# EAGLE design compashin_izzonu_fine (EAGLE 9.6.2)
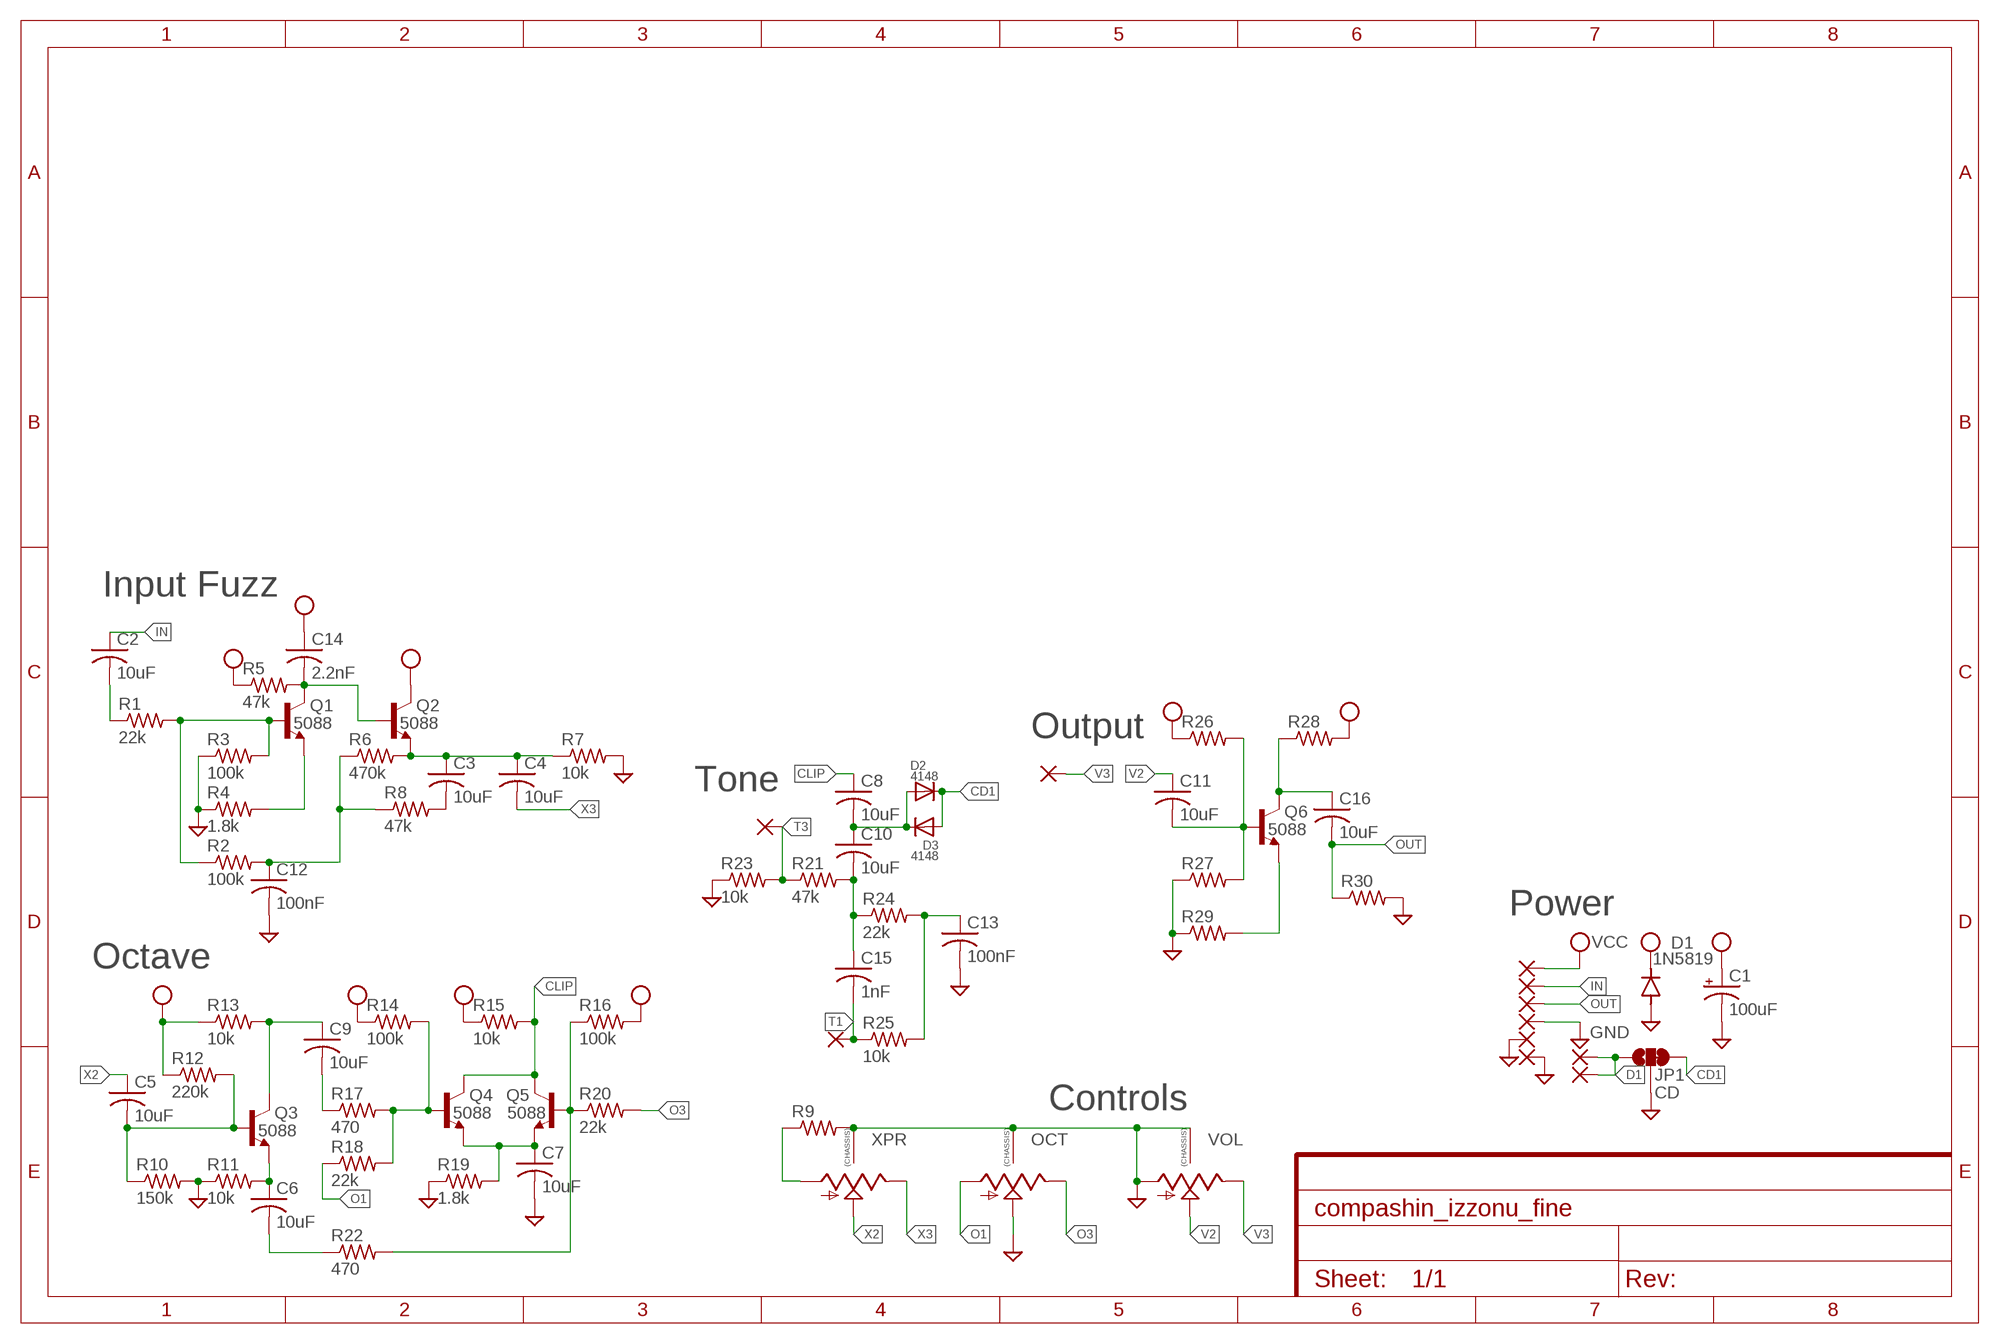
[diagram p0: schematic, sheet 1]

## Parts
C1  100uF  100UF-POLAR-RADIAL-2.5MM-25V-20%  [CPOL-RADIAL-2.5MM-6.5MM]
C2  10uF  C-USC0805  [C0805]
C3  10uF  C-USC0805  [C0805]
C4  10uF  C-USC0805  [C0805]
C5  10uF  C-USC0805  [C0805]
C6  10uF  C-USC0805  [C0805]
C7  10uF  C-USC0805  [C0805]
C8  10uF  C-USC0805  [C0805]
C9  10uF  C-USC0805  [C0805]
C10  10uF  C-USC0805  [C0805]
C11  10uF  C-USC0805  [C0805]
C12  100nF  C-USC0402  [C0402]
C13  100nF  C-USC0402  [C0402]
C14  2.2nF  C-USC0402  [C0402]
C15  1nF  C-USC0402  [C0402]
C16  10uF  C-USC0805  [C0805]
D1  1N5819  DIODE-SOD123  [SOD123]
D2  4148  DIODESOD-123  [SOD-123]
D3  4148  DIODESOD-123  [SOD-123]
JP1  CD  JUMPER-SMT_3_1-NC_TRACE_SILK  [SMT-JUMPER_3_1-NC_TRACE_SILK]
OCT  9MM_SNAP-IN_POT_CHASSIS  [9MM_SNAP-IN_POT]
PAD1  1,6/0,8  [1,6/0,8]
PAD2  1,6/0,8  [1,6/0,8]
PAD3  1,6/0,8  [1,6/0,8]
PAD4  1,6/0,8  [1,6/0,8]
PAD5  1,6/0,8  [1,6/0,8]
PAD6  1,6/0,8  [1,6/0,8]
PAD7  1,6/0,8  [1,6/0,8]
PAD8  1,6/0,8  [1,6/0,8]
Q1  5088  MMBT5088  [SOT23-BEC]
Q2  5088  MMBT5088  [SOT23-BEC]
Q3  5088  MMBT5088  [SOT23-BEC]
Q4  5088  MMBT5088  [SOT23-BEC]
Q5  5088  MMBT5088  [SOT23-BEC]
Q6  5088  MMBT5088  [SOT23-BEC]
R1  22k  R-US_R0402  [R0402]
R2  100k  R-US_R0402  [R0402]
R3  100k  R-US_R0402  [R0402]
R4  1.8k  R-US_R0402  [R0402]
R5  47k  R-US_R0402  [R0402]
R6  470k  R-US_R0402  [R0402]
R7  10k  R-US_R0402  [R0402]
R8  47k  R-US_R0402  [R0402]
R9  R-US_R0402  [R0402]
R10  150k  R-US_R0402  [R0402]
R11  10k  R-US_R0402  [R0402]
R12  220k  R-US_R0402  [R0402]
R13  10k  R-US_R0402  [R0402]
R14  100k  R-US_R0402  [R0402]
R15  10k  R-US_R0402  [R0402]
R16  100k  R-US_R0402  [R0402]
R17  470  R-US_R0402  [R0402]
R18  22k  R-US_R0402  [R0402]
R19  1.8k  R-US_R0402  [R0402]
R20  22k  R-US_R0402  [R0402]
R21  47k  R-US_R0402  [R0402]
R22  470  R-US_R0402  [R0402]
R23  10k  R-US_R0402  [R0402]
R24  22k  R-US_R0402  [R0402]
R25  10k  R-US_R0402  [R0402]
R26  R-US_R0402  [R0402]
R27  R-US_R0402  [R0402]
R28  R-US_R0402  [R0402]
R29  R-US_R0402  [R0402]
R30  R-US_R0402  [R0402]
T1  1,6/0,8  [1,6/0,8]
T2  1,6/0,8  [1,6/0,8]
T3  1,6/0,8  [1,6/0,8]
VOL  9MM_SNAP-IN_POT_CHASSIS  [9MM_SNAP-IN_POT]
XPR  9MM_SNAP-IN_POT_CHASSIS  [9MM_SNAP-IN_POT]

## Nets
CD1: D2.C D3.A JP1.3
CLIP: C8.1 Q4.C Q5.C R15.2
D1: JP1.1 PAD7.1(P) PAD8.1(P)
GND: C1.2(-) C7.2 C12.2 C13.2 D1.A JP1.2 OCT.2(S) OCT.CHASSIS1 OCT.CHASSIS2 PAD4.1(P) PAD5.1(P) PAD6.1(P) R3.1 R4.1 R7.2 R9.2 R10.2 R11.1 R19.1 R23.1 R27.1 R29.1 R30.2 VOL.1(A) VOL.CHASSIS1 VOL.CHASSIS2 XPR.CHASSIS1 XPR.CHASSIS2
IN: C2.1 PAD2.1(P)
N$1: Q1.B R1.2 R2.1 R3.2
N$2: C2.2 R1.1
N$3: C14.2 Q1.C Q2.B R5.2
N$4: Q1.E R4.2
N$5: C12.1 R2.2 R6.1 R8.1
N$6: C3.1 C4.1 Q2.E R6.2 R7.1
N$7: C3.2 R8.2
N$8: C5.2 Q3.B R10.1 R12.2
N$9: C9.1 Q3.C R13.2
N$10: R9.1 XPR.1(A)
N$11: C6.1 Q3.E R11.2
N$12: C9.2 R17.1
N$13: Q4.B R14.2 R17.2 R18.2
N$14: C8.2 C10.1 D2.A D3.C
N$15: C7.1 Q4.E Q5.E R19.2
N$16: Q5.B R16.1 R20.1 R22.2
N$17: C6.2 R22.1
N$18: C10.2 C15.1 R21.2 R24.1
N$19: C16.1 Q6.C R28.1
N$20: C13.1 R24.2 R25.2
N$21: C11.2 Q6.B R26.2 R27.2
N$22: Q6.E R29.2
O1: OCT.1(A) R18.1
O3: OCT.3(E) R20.2
OUT: C16.2 PAD3.1(P) R30.1
T1: C15.2 R25.1 T1.1(P)
T3: R21.1 R23.2 T3.1(P)
V2: C11.1 VOL.2(S)
V3: T2.1(P) VOL.3(E)
VCC: C1.1(+) C14.1 D1.C PAD1.1(P) Q2.C R5.1 R12.1 R13.1 R14.1 R15.1 R16.2 R26.1 R28.2
X2: C5.1 XPR.2(S)
X3: C4.2 XPR.3(E)

## Notes on the sheet
- Input Fuzz
- Output
- Tone
- Power
- Octave
- Controls

## Library data of the parts
C1 = SparkFun-Capacitors:100UF-POLAR: 100µF polarized capacitors A capacitor is a passive two-terminal electrical component used to store electrical energy temporarily in an electric field.; PROD_ID: CAP-08439
C2-C16 = adafruit:C-US: CAPACITOR, American symbol
D1 = diode:DIODE-: DIODE
D2 D3 = adafruit:DIODE: Diode SMADIODE - SMA Surface Mount Package 20V 1A Schottky Diode Digikey: 641-1014-6-ND DO-1N4148 - Through Hole Small Current Diode SOD-123 20V 1 A (.5mV Vf) Schottky Diode - Digikey: MBRX120TPMSCT-ND SOD-323 10V 570mA (.38mV Vf, 3ns) Schottky Diode - Digikey: ZLLS410CT-ND SOD-523 30V 30mA Schottky Diode (RB751S-40TE61) - Digikey: RB751S-40TE61CT-ND SOT23-R/W - SOT23 Package (R = Solder Paste/Reflow Ovens, W = Hand-Soldering) BAT54Film 40V 300mA - Digikey: 497-7162-1-ND
JP1 = SparkFun-Jumpers:JUMPER-SMT_3_1-NC_TRACE: Normally closed trace jumper (1 of 2 connections) This jumper has a trace between two pads so it's normally closed (NC). The other connection is normally open (NO). Use a razor knife to open the connection. For best results follow the IPC guidelines for cutting traces: Cutout at least 0.063 mm (0.005 in). Remove all loose material to clean up the cut area. Seal the cut with an approved epoxy. Reapply solder to reclose the connection, or to close the NO connection.
OCT VOL XPR = MusicThingModular:9MM_SNAP-IN_POT_CHASSIS: 9mm vertical snap-in pot, Alpha / Panasonic style, with a connection to the metal chassis for grounding
PAD1-PAD8 T1-T3 = wirepad:1,6/0,8: THROUGH-HOLE PAD
Q1-Q6 = MMBT5088_:MMBT5088*: NPN TRANSISTOR Check prices <https://pricing.snapeda.com/search/part/MMBT5088/?ref=eda>; AVAILABILITY: Good; DESCRIPTION: Bipolar (BJT) Transistor NPN 30V 100mA 50MHz 350mW Surface Mount SOT-23; MF: ON Semiconductor; MP: MMBT5088; PACKAGE: SOT-23-3 Fairchild Semiconductor; PRICE: None; PURCHASE-URL: https://pricing.snapeda.com/search/part/MMBT5088/?ref=eda
R1-R30 = adafruit:R-US_: RESISTOR, American symbol

## Board
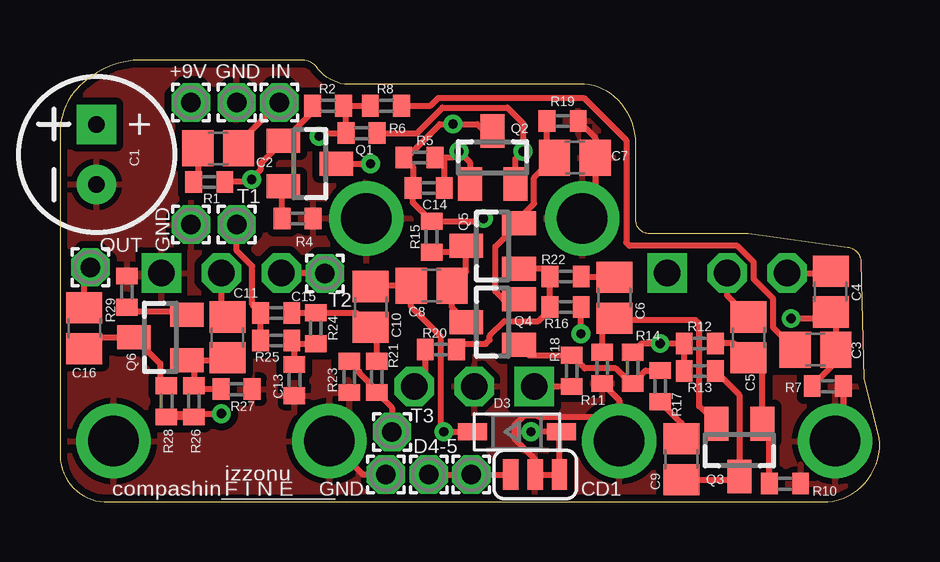
[diagram p1: board, top side]
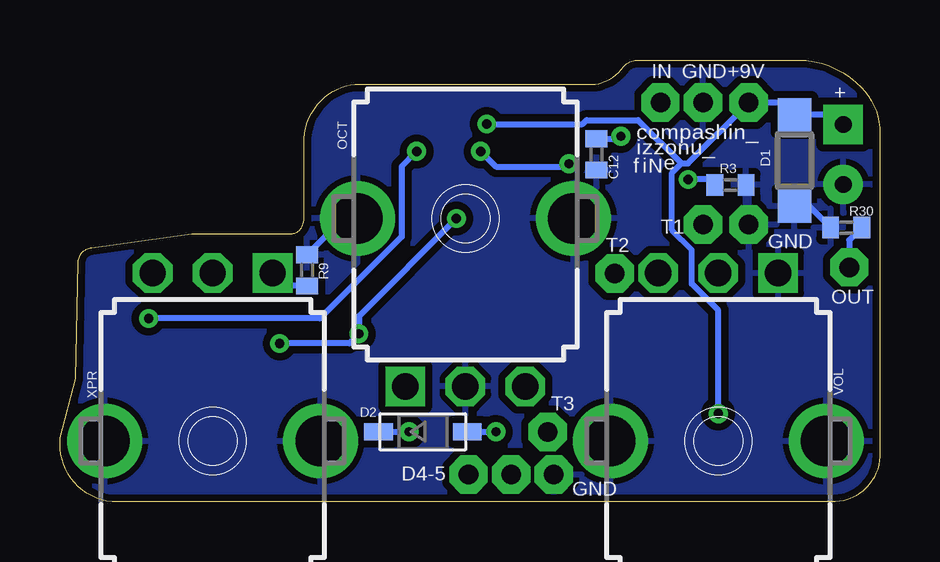
[diagram p2: board, bottom side, seen from below]

Size 34.18 x 18.41 mm. Coordinates in mm from the lower left corner, seen from the top.
Outline: 0,15.37 0,1.91 arc90 2.03,0 32,0 arc90 34.16,2.67 33.53,5.12 33.41,9.98 arc82 32.85,10.6 28.69,11.18 24.66,11.18 arc-80 24.04,11.57 24,11.77 24,15.13 arc45 23.11,16.89 arc45 21.48,17.4 11.86,17.4 arc-45 10.67,18.16 arc45 10.05,18.41 3.38,18.41 arc45 0.76,17.27 0.77,17.28 arc45 0,15.37
Copper layers (1*16): Top 0.035mm / dielectric 1.5mm / Bottom 0.035mm
Design rules "default *": minimum track width 6mil, minimum drill 0.35mm, track to track 6mil, track to pad 6mil, pad to pad 6mil, via to via 6mil, smd to smd 6mil, copper to edge 10mil, drill to drill 6mil, minimum pad ring 10mil, minimum via ring 8mil, stop-mask expansion 4mil, vias tented up to drill 0mil, thermal gap 10mil

### Footprints (pad centres in the part's own frame; a part is rotated, then mirrored left to right if it is on the bottom)
CPOL-RADIAL-2.5MM-6.5MM = drill 0.7 pad 1.651 square: 1 1.25,0 | drill 0.7 pad 1.651: 2 -1.25,0
C0805 = smd 1.3 x 1.5: 1 -0.85,0; 2 0.85,0
C0402 = smd 0.7 x 0.9: 1 -0.65,0; 2 0.65,0
SOD123 = smd 1.4 x 1.4: A 1.9,0; C -1.9,0
SOD-123 = smd 1.2 x 0.7: A 1.85,0; C -1.85,0
SMT-JUMPER_3_1-NC_TRACE_SILK = smd 0.635 x 1.27: 1 -1.016,0; 2 0,0; 3 1.016,0
9MM_SNAP-IN_POT = drill 1.1 square: 1 -2.5,-7 | drill 1.1 octagon: 2 0,-7; 3 2.5,-7 | drill 2.1 pad 2.794: CHASSIS1 -4.5,0; CHASSIS2 4.5,0
1,6/0,8 = drill 0.813 pad 1.6 octagon: 1 0,0
SOT23-BEC = smd 1 x 1.4: B -0.95,-1.1; C 0,1.1; E 0.95,-1.1
R0402 = smd 0.7 x 0.9: 1 -0.65,0; 2 0.65,0

### Placement (x,y rotation side)
C1  1.52,14.48 90 top
C2  6.6,14.73 180 top
C3  31.5,6.35 180 top
C4  32.13,8.76 90 top
C5  28.7,6.86 270 top
C6  23.11,8.51 90 top
C7  21.46,14.35 0 top
C8  15.49,9.02 180 top
C9  25.91,1.78 90 top
C10  12.95,8.13 270 top
C11  6.99,6.86 270 top
C12  11.81,14.48 270 bottom
C13  9.78,5.08 270 top
C14  15.37,13.08 0 top
C15  9.02,7.87 180 top
C16  1.02,7.24 90 top
D1  3.56,14.22 270 bottom
D2  19.05,2.92 0 bottom
D3  19.05,2.92 0 top
JP1  19.81,1.14 0 top
OCT  17.27,11.81 0 bottom
PAD1  5.46,16.64 0 top
PAD2  9.14,16.64 0 top
PAD3  1.27,9.78 0 top
PAD4  5.46,11.56 0 top
PAD5  13.59,1.14 0 top
PAD6  7.37,16.64 0 top
PAD7  17.14,1.14 0 top
PAD8  15.37,1.14 0 top
Q1  10.41,14.1 270 top
Q2  18.03,14.35 0 top
Q3  28.32,2.16 180 top
Q4  18.03,7.49 90 top
Q5  18.03,10.67 90 top
Q6  4.19,6.86 90 top
R1  6.22,13.34 0 top
R2  11.18,16.51 0 top
R3  6.22,13.21 180 bottom
R4  9.91,11.81 180 top
R5  14.99,14.35 0 top
R6  12.57,15.37 0 top
R7  32,4.83 0 top
R8  13.59,16.51 0 top
R9  23.88,9.65 90 bottom
R10  30.23,0.76 0 top
R11  22.61,5.59 90 top
R12  26.67,6.6 0 top
R13  26.67,5.46 0 top
R14  23.88,5.59 270 top
R15  15.49,11.05 270 top
R16  21.08,8.13 0 top
R17  25.02,4.83 90 top
R18  21.34,5.46 90 top
R19  20.95,15.88 180 top
R20  15.88,6.35 180 top
R21  13.21,5.21 90 top
R22  21.08,9.4 180 top
R23  12.06,5.21 90 top
R24  10.67,7.24 270 top
R25  9.02,6.73 0 top
R26  5.59,4.19 90 top
R27  7.37,4.7 180 top
R28  4.45,4.19 270 top
R29  2.79,8.76 270 top
R30  1.4,11.43 180 bottom
T1  7.37,11.56 0 top
T2  11.05,9.53 0 top
T3  13.84,2.92 0 top
VOL  6.73,2.54 180 bottom
XPR  27.81,2.54 180 bottom

### Tracks (layer width: path | path; a pad name or v marks a point on that pad's centre or on a via)
CD1  (via drill 0.38)
  Top 0.254: v19.63,2.92 D3.A 20.83,2.85 JP1.3
  Bottom 0.254: D3.A v19.63,2.92
CLIP
  Top 0.254: R15.2 16.66,10.4 Q5.C 16.93,9.61 C8.1 16.34,8.08 Q4.C
D1
  Top 0.254: PAD8.1 PAD7.1 JP1.1
GND
  Top 0.254: R19.1 22.31,15.17 C7.2 22.31,12.35 OCT.CHASSIS1 | R11.1 23.31,4.23 23.31,2.79 | 23.31,2.79 XPR.CHASSIS1 | 23.31,2.79 22.55,3.56 19.95,3.56 19.91,3.59 19.35,3.59 18.96,3.2 18.96,2.64 19.68,1.91 19.81,1.78 JP1.2 | PAD5.1 12.63,1.14 VOL.CHASSIS2 | R7.2 32.65,2.88 XPR.CHASSIS2
  Bottom 0.254: R30.2 2.94,12.32 D1.A | R9.2 22.37,11.81 OCT.CHASSIS1
  pour Bottom (isolate 0.305): -1.27,19.05 -1.27,-2.54 35.56,-2.54 35.56,19.05
  pour Top (isolate 0.305): -1.27,19.05 -1.27,-2.54 35.56,-2.54 35.56,19.05
IN
  Top 0.254: C2.1 7.45,14.95 PAD2.1
N$1  (via drill 0.38)
  Top 0.254: R2.1 10.53,16.26 Q1.B 8.38,14.12 8.38,13.87 7.99,13.47 v7.99,13.44 7.89,13.34 R1.2
  Bottom 0.254: R3.2 7.1,13.44 v7.99,13.44
N$2
  Top 0.254: C2.2 5.75,13.52 R1.1
N$3  (via drill 0.38)
  Top 0.254: 16.02,14.35 C14.2 | Q1.C v12.95,14.1 | Q2.B 17.08,14.16 v16.64,14.61 16.38,14.35 16.02,14.35 | 16.02,14.35 R5.2
  Bottom 0.254: v12.95,14.1 13.08,13.97 16,13.97 v16.64,14.61
N$4
  Top 0.254: R4.2 9.26,13.09 Q1.E
N$5  (via drill 0.38)
  Top 0.254: R8.1 R2.2 11.92,16.41 R6.1 10.92,15.37 v10.79,15.24
  Bottom 0.254: C12.1 10.91,15.13 v10.79,15.24
N$6  (via drill 0.38)
  Top 0.254: R6.2 14.88,15.37 15.95,16.43 18.65,16.43 19.3,15.78 v19.3,14.61 18.98,14.29 Q2.E | C4.1 32.15,7.89 | 32.15,7.89 32.35,7.7 C3.1 32.35,5.82 R7.1 | v30.48,7.65 31.9,7.65 32.15,7.89
  Bottom 0.254: v19.3,14.61 19.93,13.97 19.93,11.05 23.34,7.65 v30.48,7.65
N$7
  Top 0.254: R8.2 15.45,16.51 15.78,16.84 21.84,16.84 23.61,15.07 23.61,10.81 23.75,10.67 28.25,10.67 28.92,10 28.92,9.29 29.73,8.47 29.73,7.26 C3.2
N$8
  Top 0.254: R10.1 29.58,2.95 Q3.B 29.27,5.44 C5.2 28.11,6.6 R12.2
N$9
  Top 0.254: R13.2 28.32,4.46 Q3.C 28.19,0.93 C9.1
N$10
  Bottom 0.254: R9.1 24.77,9 XPR.1
N$11
  Top 0.254: R11.2 22.61,7.15 23.03,7.58 | 23.03,7.58 C6.1 | Q3.E 26.65,3.98 26.65,7.42 26.5,7.58 23.03,7.58
N$12
  Top 0.254: R17.1 25.91,3.29 C9.2
N$13
  Top 0.254: Q4.B 19.57,6.11 R18.2 21.88,5.57 23.17,5.57 23.8,4.94 R14.2 24.41,5.48 R17.2
N$14  (via drill 0.38)
  Top 0.254: C10.1 12.99,9.02 C8.2 14.64,8.13 15.88,6.89 15.88,3.05 v16,2.92 D2.A
  Bottom 0.254: D2.A v16,2.92
N$15
  Top 0.254: Q4.E 18.48,8.44 18.16,8.77 18.16,10.64 Q5.E 19.13,11.81 19.76,12.44 19.76,13.5 C7.1 20.3,14.66 R19.2
N$16
  Top 0.254: R20.1 16.76,6.59 17.75,6.59 17.91,6.75 17.91,6.92 18.53,7.54 19.95,7.54 20.37,7.95 20.37,7.94 20.43,8 R16.1 R22.2 20.11,9.72 Q5.B
N$17
  Top 0.254: C6.2 21.77,9.36 R22.1
N$18
  Top 0.254: C15.1 9.68,7.89 R24.1 12.34,7.89 C10.2 13.21,7.02 R21.2
N$19
  Top 0.254: C16.1 1.49,6.86 Q6.C 4.18,5.76 4.18,5.04 4.45,4.78 R28.1
N$20
  Top 0.254: C13.1 9.78,6.62 R25.2 9.81,6.59 R24.2
N$21
  Top 0.254: C11.2 6.88,5.91 Q6.B 5.59,5.61 R26.2 5.73,4.7 R27.2
N$22
  Top 0.254: R29.2 2.97,7.93 5.16,7.93 Q6.E
O1
  Top 0.254: OCT.1 R18.1
O3
  Top 0.254: OCT.3 15.22,5.26 R20.2
OUT
  Top 0.254: C16.2 1.02,9.53 PAD3.1
  Bottom 0.254: R30.1 1.27,10.91 PAD3.1
T1
  Top 0.254: R25.1 C15.2 8.01,8.23 8.01,9.82 7.37,10.47 T1.1
T3
  Top 0.254: R23.2 12.48,5.44 12.48,5.39 13.21,4.66 R21.1 13.84,3.92 T3.1
V2
  Top 0.254: C11.1 6.73,7.96 VOL.2
V3
  Top 0.254: T2.1 9.25,9.53 VOL.3
VCC  (via drill 0.38)
  Top 0.254: R26.1 R28.2 4.59,3.68 v6.73,3.68 | Q2.C 17.86,15.28 17.39,15.75 v16.38,15.75 15.84,15.75 14.44,14.35 R5.1 14.72,13.97 C14.1 14.72,12.48 R15.1 17.54,11.7 v17.65,11.81 | R14.1 24.24,6.6 v25.02,6.6 R12.1 R13.1 | v21.72,7.01 21.72,8.11 R16.2
  Bottom 0.254: C1.1 1.92,16.12 D1.C 4.07,16.64 PAD1.1 7.99,14.11 8.27,14.11 | v17.65,11.81 21.72,7.75 v21.72,7.01 22.12,6.6 v25.02,6.6 | 8.27,14.11 8.66,13.71 8.66,11.33 7.83,10.5 7.83,9.08 6.73,7.98 v6.73,3.68 | v16.38,15.75 12.39,15.75 12.22,15.91 10.07,15.91 8.27,14.11
X2
  Top 0.254: C5.1 27.81,8.6 XPR.2
X3
  Top 0.254: XPR.3 32.06,9.54 C4.2

### Text on the board
tPlace: +9V | GND | IN | + | T1 | OUT | GND | T2 | T3 | D4-5 | izzonu | compashin_________ | F I N E | GND | CD1
bPlace: +9V | GND | IN | + | compashin_ | e | N | i | izzonu_ | f | GND | T1 | T2 | OUT | T3 | D4-5 | GND